# EAGLE design Inter IIT (EAGLE 7.3.0)
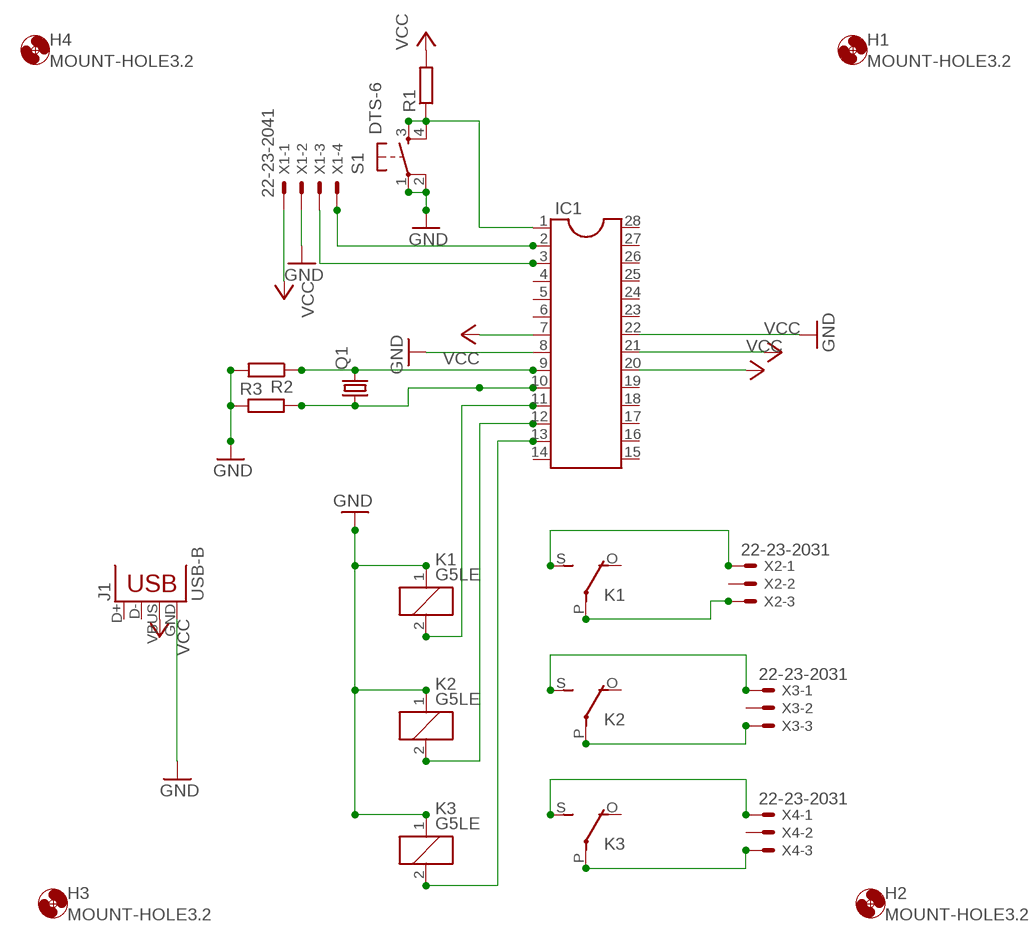
[diagram p0: schematic, sheet 1]

## Parts
H1  MOUNT-HOLE3.2  [3,2]
H2  MOUNT-HOLE3.2  [3,2]
H3  MOUNT-HOLE3.2  [3,2]
H4  MOUNT-HOLE3.2  [3,2]
IC1  DIL28-3  [DIL28-3]
J1  USB-B  USBPTH  [USB-B-PTH]
K1  G5LE  [G5LE]
K2  G5LE  [G5LE]
K3  G5LE  [G5LE]
Q1  CRYSTALHC49S  [HC49/S]
R1  RESISTOR7.5MM  [RESISTOR7.5MM]
R2  RESISTOR7.5MM  [RESISTOR7.5MM]
R3  RESISTOR7.5MM  [RESISTOR7.5MM]
S1  DTS-6  [DTS-6]
X1  22-23-2041  [22-23-2041]
X2  22-23-2031  [22-23-2031]
X3  22-23-2031  [22-23-2031]
X4  22-23-2031  [22-23-2031]

## Nets
GND: IC1.8 IC1.22 J1.GND K1.1 K2.1 K3.1 R2.2 R3.1 S1.1 S1.2 X1.2
N$1: IC1.2 X1.4
N$2: IC1.3 X1.3
N$3: IC1.1 R1.1 S1.3 S1.4
N$4: IC1.9 Q1.2 R2.1
N$5: IC1.12 K2.2
N$7: IC1.11 K1.2
N$8: IC1.10 Q1.1 R3.2
N$9: IC1.13 K3.2
N$10: K1.S(2:S) X2.1
N$11: K1.P(2:P) X2.3
N$12: K2.S(2:S) X3.1
N$13: K2.P(2:P) X3.3
N$14: K3.S(2:S) X4.1
N$15: K3.P(2:P) X4.3
VCC: IC1.7 IC1.20 IC1.21 J1.VBUS R1.2 X1.1
Unconnected: IC1.4 IC1.5 IC1.6 IC1.14 IC1.15 IC1.16 IC1.17 IC1.18 IC1.19 IC1.23 IC1.24 IC1.25 IC1.26 IC1.27 IC1.28 J1.D+ J1.D- K1.O(2:O) K2.O(2:O) K3.O(2:O) X2.2 X3.2 X4.2

## Library data of the parts
H1-H4 = holes:MOUNT-HOLE: MOUNTING HOLE with drill center marker
IC1 = ic-package:DIL28: Dual In Line
J1 = SparkFun-Connectors:USB: USB Connectors USB-B-PTH is fully proven SKU : PRT-00139/CONN-08278 USB-miniB is fully proven SKU : PRT-00587 USB-A-PCB is untested. USB-A-H is throughly reviewed, but untested. Spark Fun Electronics SKU : PRT-00437 USB-B-SMT is throughly reviewed, but untested. Needs silkscreen touching up. USB-A-S has not been used/tested USB-MB-H has not been used/tested USB-MICROB has been used. CONN-09505; PROD_ID: CONN-08278
K1-K3 = relay:G5LE: RELAY 1 x switch, 10 A/120 V AC, 8 A/30 V DC, Omron; OC_FARNELL: unknown; OC_NEWARK: unknown
Q1 = adafruit:CRYSTAL: CRYSTAL; OC_FARNELL: 1667008; OC_NEWARK: unknown
R1-R3 = Robocon2k14:RESISTOR
S1 = switch-tact:DTS-6
X1 = Robocon2k14:22-23-2041: .100" (2.54mm) Center Header - 4 Pin; MF: MOLEX; MPN: 22-23-2041; OC_FARNELL: 1462920; OC_NEWARK: 38C0355
X2-X4 = Robocon2k14:22-23-2031: .100" (2.54mm) Center Header - 3 Pin; MF: MOLEX; MPN: 22-23-2031; OC_FARNELL: 1462950; OC_NEWARK: 30C0862

## Net classes
0 default: width 0.406 mm, clearance 0.406 mm

## Board
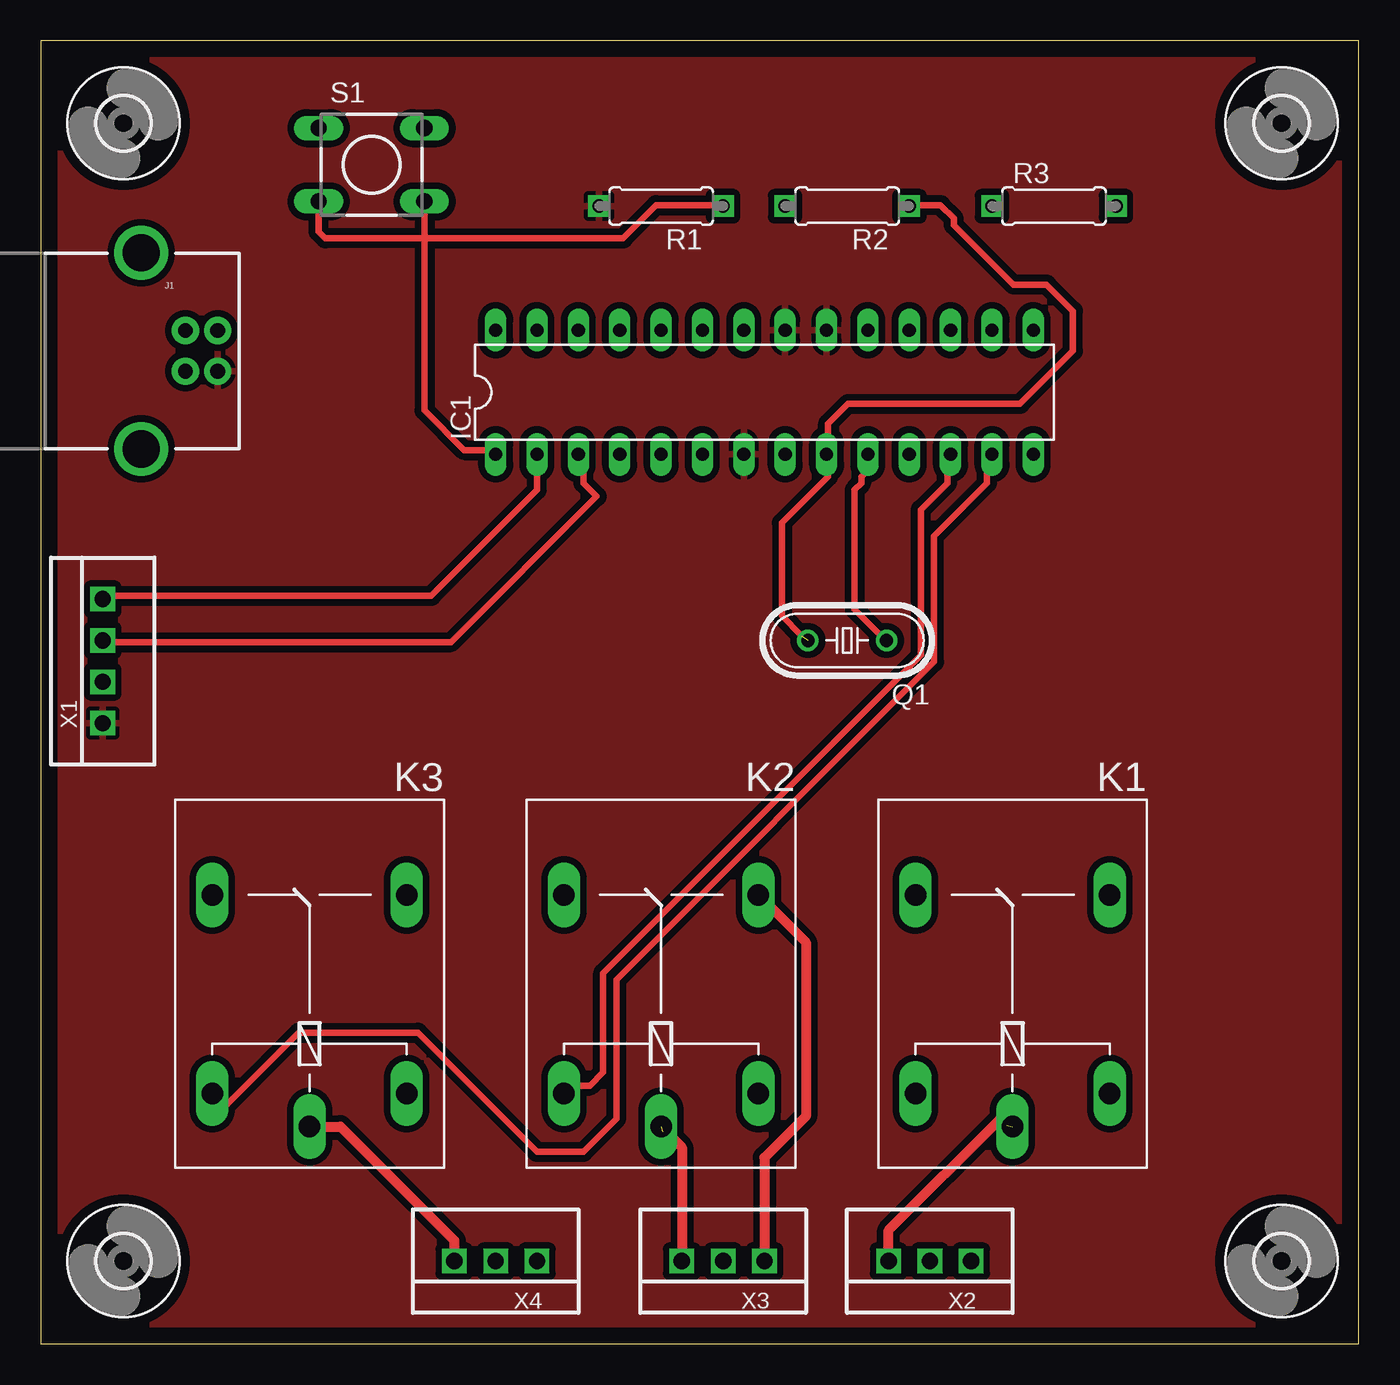
[diagram p1: board, top side]
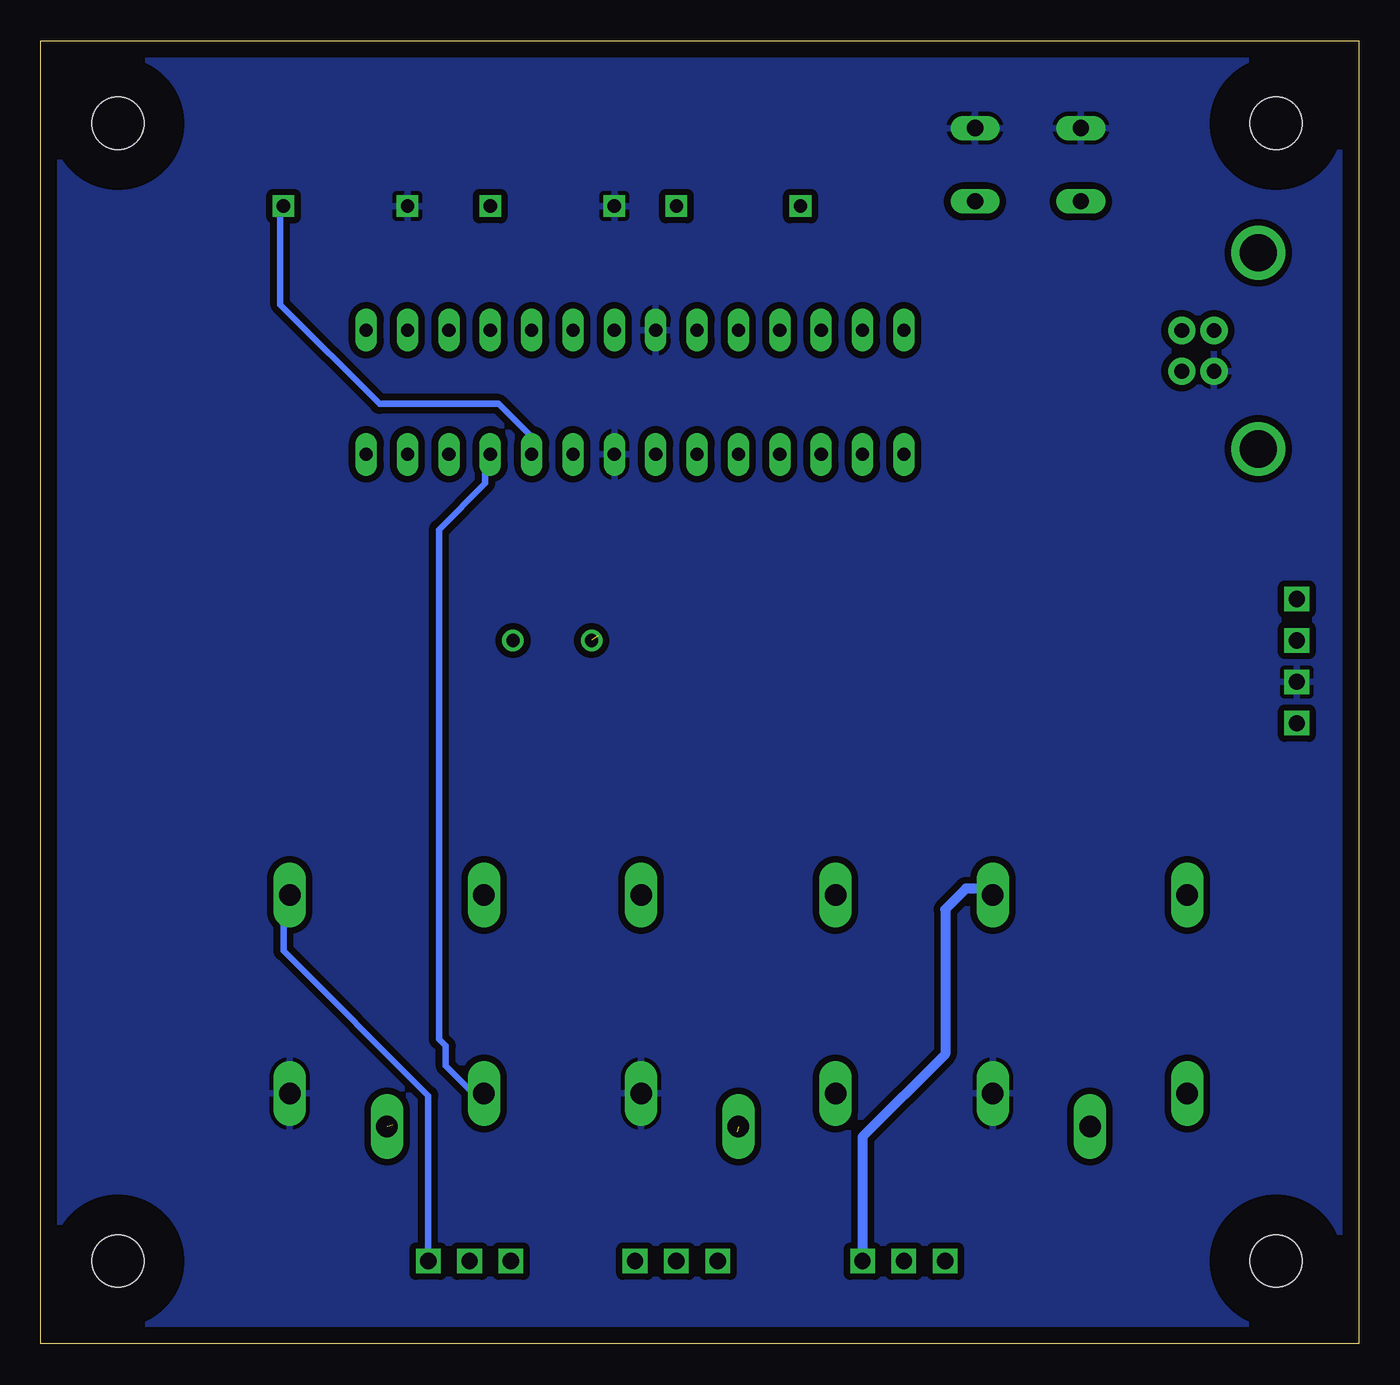
[diagram p2: board, bottom side, seen from below]

Size 80.95 x 80 mm. Coordinates in mm from the lower left corner, seen from the top.
Outline: 0,0 80.95,0 80.95,80 0,80 0,0
Copper layers (1*16): Top 0.035mm / dielectric 1.5mm / Bottom 0.035mm
Design rules "default": minimum track width 10mil, minimum drill 24mil, track to track 8mil, track to pad 8mil, pad to pad 8mil, via to via 8mil, smd to smd 8mil, copper to edge 40mil, drill to drill 8mil, minimum pad ring 10mil, minimum via ring 8mil, stop-mask expansion 4mil, vias tented up to drill 0mil, thermal gap 10mil

### Footprints (pad centres in the part's own frame; a part is rotated, then mirrored left to right if it is on the bottom)
3,2 = hole 3.2: 0,0
DIL28-3 = drill 0.813 long: 1 -16.51,-3.81; 2 -13.97,-3.81; 3 -11.43,-3.81; 4 -8.89,-3.81; 5 -6.35,-3.81; 6 -3.81,-3.81; 7 -1.27,-3.81; 8 1.27,-3.81; 9 3.81,-3.81; 10 6.35,-3.81; 11 8.89,-3.81; 12 11.43,-3.81; 13 13.97,-3.81; 14 16.51,-3.81; 15 16.51,3.81; 16 13.97,3.81; 17 11.43,3.81; 18 8.89,3.81; 19 6.35,3.81; 20 3.81,3.81; 21 1.27,3.81; 22 -1.27,3.81; 23 -3.81,3.81; 24 -6.35,3.81; 25 -8.89,3.81; 26 -11.43,3.81; 27 -13.97,3.81; 28 -16.51,3.81
USB-B-PTH = drill 0.914 pad 1.676: D+ 0,1.25; D- 1.981,1.25; GND 0,-1.25; VBUS 1.981,-1.25 | drill 2.286: S1 -2.718,-6.02; S2 -2.718,6.02
G5LE = drill 1.321 long: 1 -7.493,-5.969; 2 -7.493,5.969; O 4.699,5.969; P -9.525,0; S 4.699,-5.969
HC49/S = drill 0.813: 1 -2.413,0; 2 2.413,0
RESISTOR7.5MM = drill 0.813 square: 1 -3.81,0; 2 3.81,0
DTS-6 = drill 1 long: 1 -3.25,2.25; 2 3.25,2.25; 3 -3.25,-2.25; 4 3.25,-2.25
22-23-2041 = drill 1 square: 1 -3.81,0; 2 -1.27,0; 3 1.27,0; 4 3.81,0
22-23-2031 = drill 1 square: 1 -2.54,0; 2 0,0; 3 2.54,0

### Placement (x,y rotation side)
H1  5.08,5.08 0 top
H2  5.08,74.93 0 top
H3  76.2,5.08 0 top
H4  76.2,74.93 0 top
IC1  44.45,58.42 0 top
J1  8.89,60.96 0 top
K1  59.69,22.86 90 top
K2  38.1,22.86 90 top
K3  16.51,22.86 90 top
Q1  49.53,43.18 180 top
R1  38.1,69.85 180 top
R2  49.53,69.85 180 top
R3  62.23,69.85 0 top
S1  20.32,72.39 0 top
X1  3.81,41.91 90 top
X2  54.61,5.08 180 top
X3  41.91,5.08 180 top
X4  27.94,5.08 180 top

### Tracks (layer width: path | path; a pad name or v marks a point on that pad's centre or on a via)
GND
  pour Bottom: -7.62,85.09 88.9,85.09 88.9,-6.35 -7.62,-6.35
N$1
  Top 0.406: IC1.2 30.48,52.43 23.98,45.92 4.06,45.92 X1.4
N$2
  Top 0.406: IC1.3 33.33,54.46 33.33,52.83 34.14,52.02 25.2,43.08 4.06,43.08 X1.3
N$3
  Top 0.406: 23.57,67.87 23.57,69.9 S1.4 | 23.57,67.87 23.57,57.3 26.01,54.86 27.64,54.86 IC1.1 | 23.57,67.87 35.76,67.87 37.8,69.9 41.86,69.9 R1.1 | 23.57,67.87 17.48,67.87 17.07,68.28 17.07,69.9 S1.3
N$4  (1 unrouted)
  Top 0.406: 46.74,43.48 45.52,44.7 45.52,50.39 48.36,53.24 48.36,54.46 IC1.9 48.36,54.86 48.36,56.49 49.58,57.71 60.15,57.71 63.4,60.96 63.4,63.4 61.77,65.02 59.74,65.02 56.08,68.68 56.08,69.09 55.27,69.9 53.65,69.9 R2.1
N$5
  Top 0.406: IC1.12 55.68,54.46 55.68,52.83 54.05,51.21 54.05,42.27 34.54,22.76 34.54,16.66 33.73,15.85 32.51,15.85 32.11,15.44 K2.2
N$7
  Bottom 0.406: IC1.11 53.65,54.46 53.65,52.83 56.49,49.99 56.49,18.69 56.08,18.29 56.08,17.07 54.05,15.04 K1.2
N$8
  Top 0.406: IC1.10 50.8,53.65 50.39,53.24 50.39,52.83 49.99,52.43 49.99,45.11 51.61,43.48 Q1.1
  Bottom 0.406: IC1.10 50.8,55.68 52.83,57.71 60.15,57.71 66.24,63.8 66.24,69.49 R3.2
N$9
  Top 0.406: IC1.13 58.12,54.46 58.12,52.83 54.86,49.58 54.86,41.86 35.36,22.35 35.36,13.82 33.33,11.79 30.48,11.79 23.16,19.1 15.85,19.1 11.38,14.63 10.97,14.63 10.57,15.04 K3.2
N$10
  Bottom 0.406: X2.1 57.15,15.24 66.04,24.13 66.04,27.18 K1.S
N$11  (1 unrouted)
  Top 0.406: 59.33,13.41 58.93,13.82
  Top 0.61: X2.3 52.07,6.96 58.93,13.82 | K1.P 59.69,12.7
N$12
  Top 0.61: K2.S 46.99,24.64 46.99,13.97 44.45,11.43 X3.1
N$13  (1 unrouted)
  Top 0.406: 38.2,13.01 38.2,12.19
  Top 0.61: K2.P 39.37,12.06 X3.3
N$14
  Bottom 0.406: 22.76,27.64 K3.S
  Bottom 0.61: 22.76,27.64 23.06,27.94 24.13,27.94 25.4,26.67 25.4,17.78 30.48,12.7 X4.1
N$15
  Top 0.406: 25.6,5.28 X4.3
  Top 0.61: K3.P 18.41,13.34 25.4,6.35 X4.3
VCC
  pour Top: -3.81,82.55 85.09,82.55 85.09,-2.54 -3.81,-2.54